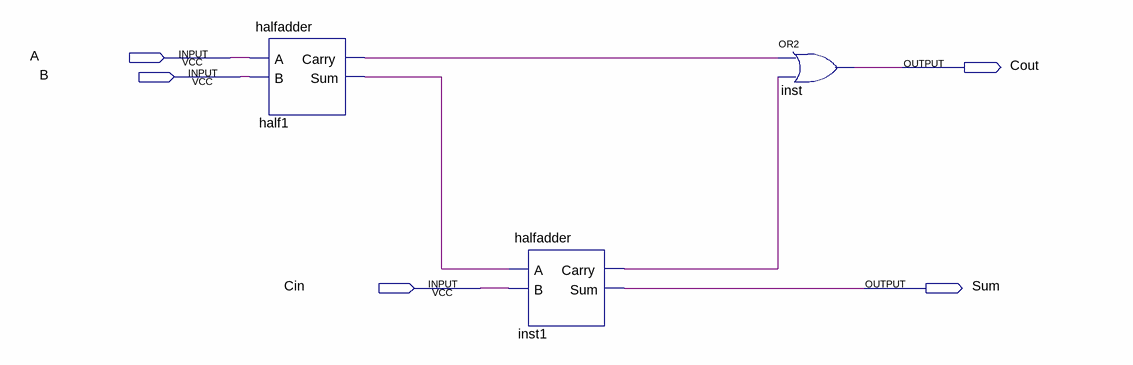
[diagram p0: schematic sheet]
// Quartus schematic fulladder.bdf as structural Verilog: 3 symbols, 5 pins
module fulladder (
  input  A,
  input  B,
  input  Cin,
  output Cout,
  output Sum
);

  wire half1_carry, half1_sum, inst1_carry;

  halfadder half1 (.A(A), .B(B), .Carry(half1_carry), .Sum(half1_sum));
  halfadder inst1 (.A(half1_sum), .B(Cin), .Carry(inst1_carry), .Sum(Sum));
  or inst (Cout, half1_carry, inst1_carry);
endmodule
